# EAGLE design main (EAGLE 9.1.0)
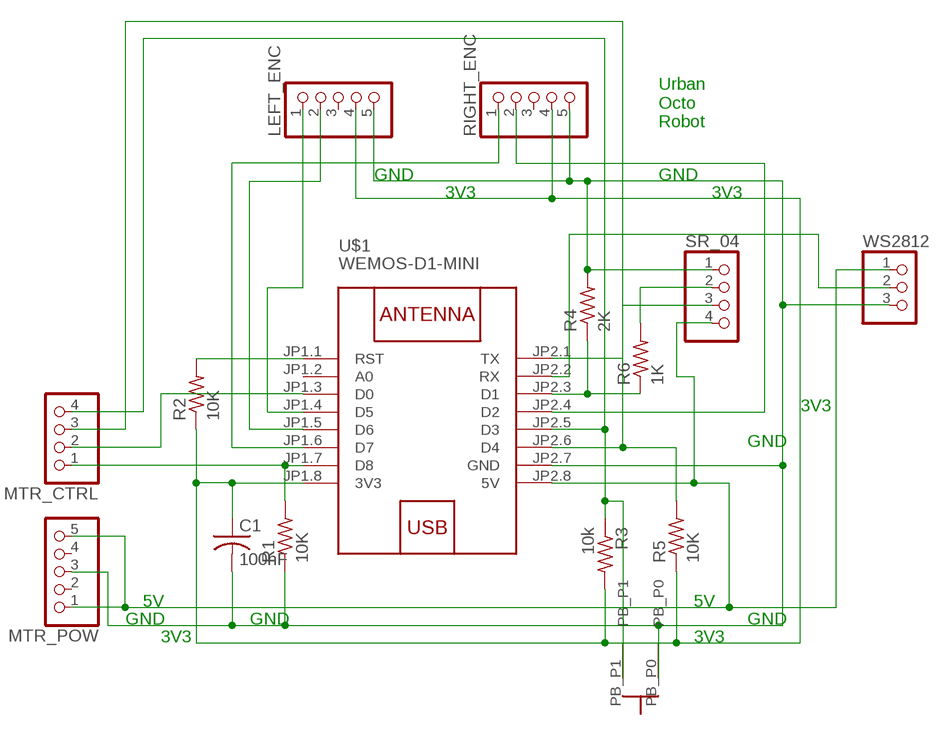
[diagram p0: schematic, sheet 1]

## Parts
C1  100nF  C-US050-024X044  [C050-024X044]
LEFT_ENC  PINHD-1X5  [1X05]
MTR_CTRL  PINHD-1X4  [1X04]
MTR_POW  PINHD-1X5/90  [1X05/90]
R1  10K  R-US_0204/7  [0204/7]
R2  10K  R-US_0204/7  [0204/7]
R3  10k  R-US_0207/2V  [0207/2V]
R4  2K  R-US_0309/V  [0309V]
R5  10K  R-US_0204/7  [0204/7]
R6  1K  R-US_0309/V  [0309V]
RIGHT_ENC  PINHD-1X5  [1X05]
SR_04  PINHD-1X4  [1X04]
U$1  WEMOS-D1-MINI  [WEMOS-D1-MINI]
U$7  BUTTON6X6X10MMSIDE  [BUTTON6X6X10MMSIDE]
WS2812  PINHD-1X3  [1X03]

## Nets
N$1: U$1.JP2.2(RX) WS2812.2
N$2: MTR_POW.1 MTR_POW.5 SR_04.4 U$1.JP2.8(5V) WS2812.1
N$3: LEFT_ENC.1 U$1.JP1.4(D5)
N$4: MTR_CTRL.2 U$1.JP1.3(D0)
N$5: RIGHT_ENC.2 U$1.JP2.4(D2)
N$6: LEFT_ENC.2 U$1.JP1.5(D6)
N$7: RIGHT_ENC.1 U$1.JP1.6(D7)
N$8: C1.1 LEFT_ENC.4 R2.1 R3.2 R5.1 RIGHT_ENC.4 U$1.JP1.8(3V3)
N$9: R6.2 SR_04.2
N$10: MTR_CTRL.4 R3.1 U$1.JP2.5(D3) U$7.PB_P1
N$11: R4.1 R6.1 U$1.JP2.3(D1)
N$12: SR_04.3 U$1.JP2.1(TX)
N$13: MTR_CTRL.3 R5.2 U$1.JP2.6(D4)
N$14: R2.2 U$1.JP1.1(RST)
N$15: MTR_CTRL.1 R1.2 U$1.JP1.7(D8)
N$16: C1.2 LEFT_ENC.5 MTR_POW.3 R1.1 R4.2 RIGHT_ENC.5 SR_04.1 U$1.JP2.7(GND) U$7.PB_P0 WS2812.3
Unconnected: LEFT_ENC.3 MTR_POW.2 MTR_POW.4 RIGHT_ENC.3 U$1.JP1.2(A0)

## Notes on the sheet
- Urban
  Octo
  Robot
- GND | GND
- 3V3 | 3V3
- 3V3
- GND
- 5V | 5V
- GND | GND | GND
- 3V3 | 3V3

## Library data of the parts
C1 = resistor:C-US: CAPACITOR, American symbol
LEFT_ENC MTR_POW RIGHT_ENC = pinhead:PINHD-1X5: PIN HEADER
MTR_CTRL SR_04 = pinhead:PINHD-1X4: PIN HEADER
R1-R6 = resistor:R-US_: RESISTOR, American symbol
U$1 = diy-modules:WEMOS-D1-MINI: WEMOS D1 mini: Mini Wi-Fi Board based on ESP-8266 device More details can be found here: https://www.wemos.cc/product/d1-mini.html Click here to find device on ebay.com <http://www.ebay.com/sch/wemos+d1+mini+nodemcu>
U$7 = glowmouse_custom:BUTTON6X6X10MMSIDE
WS2812 = pinhead:PINHD-1X3: PIN HEADER

## Board
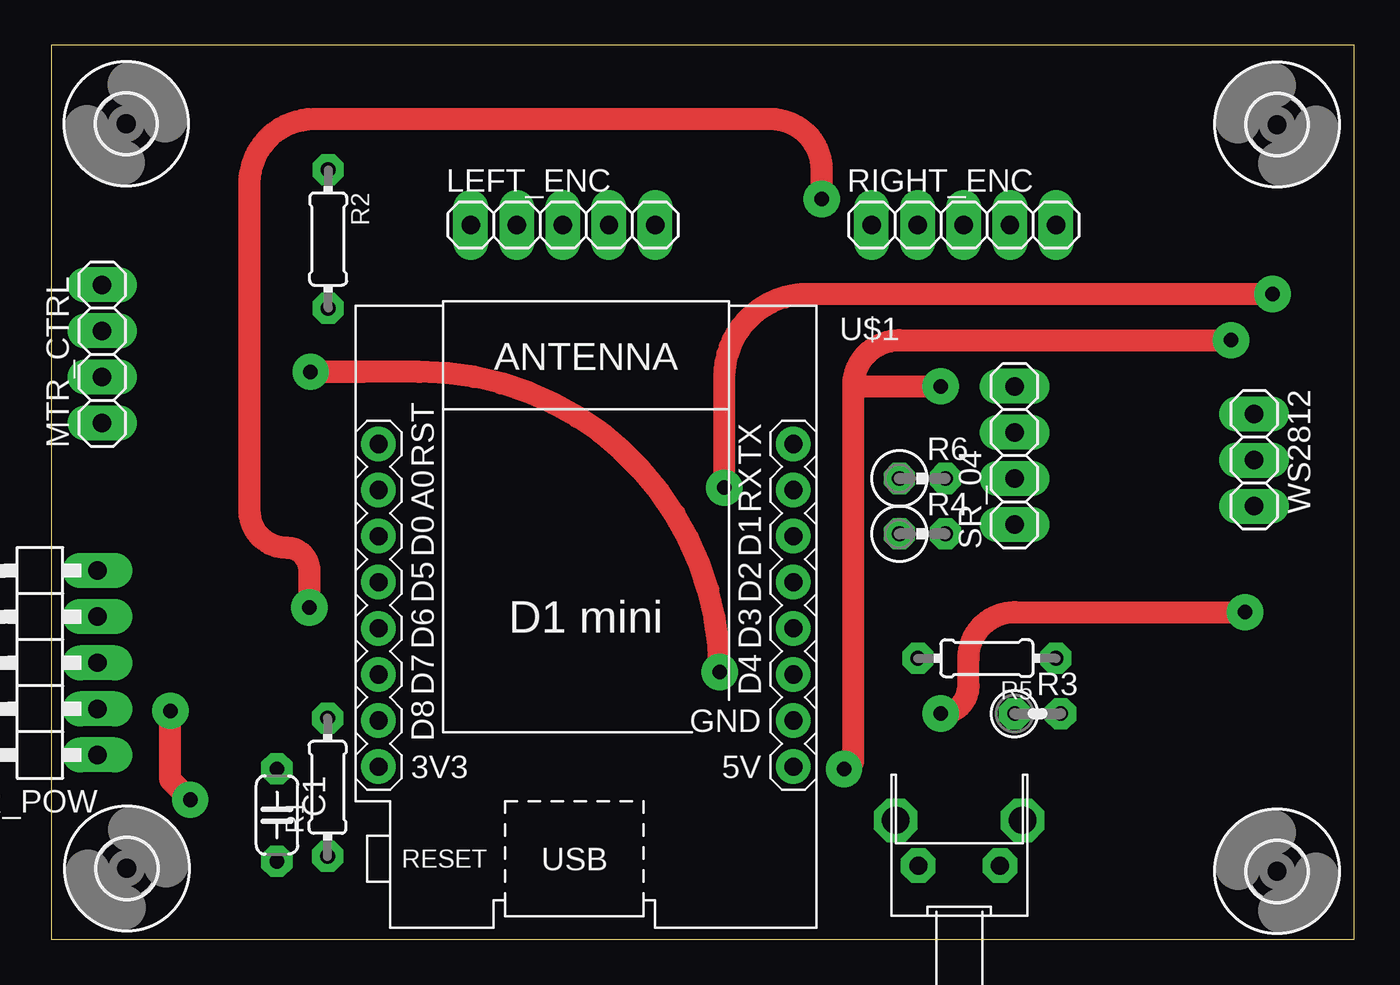
[diagram p1: board, top side]
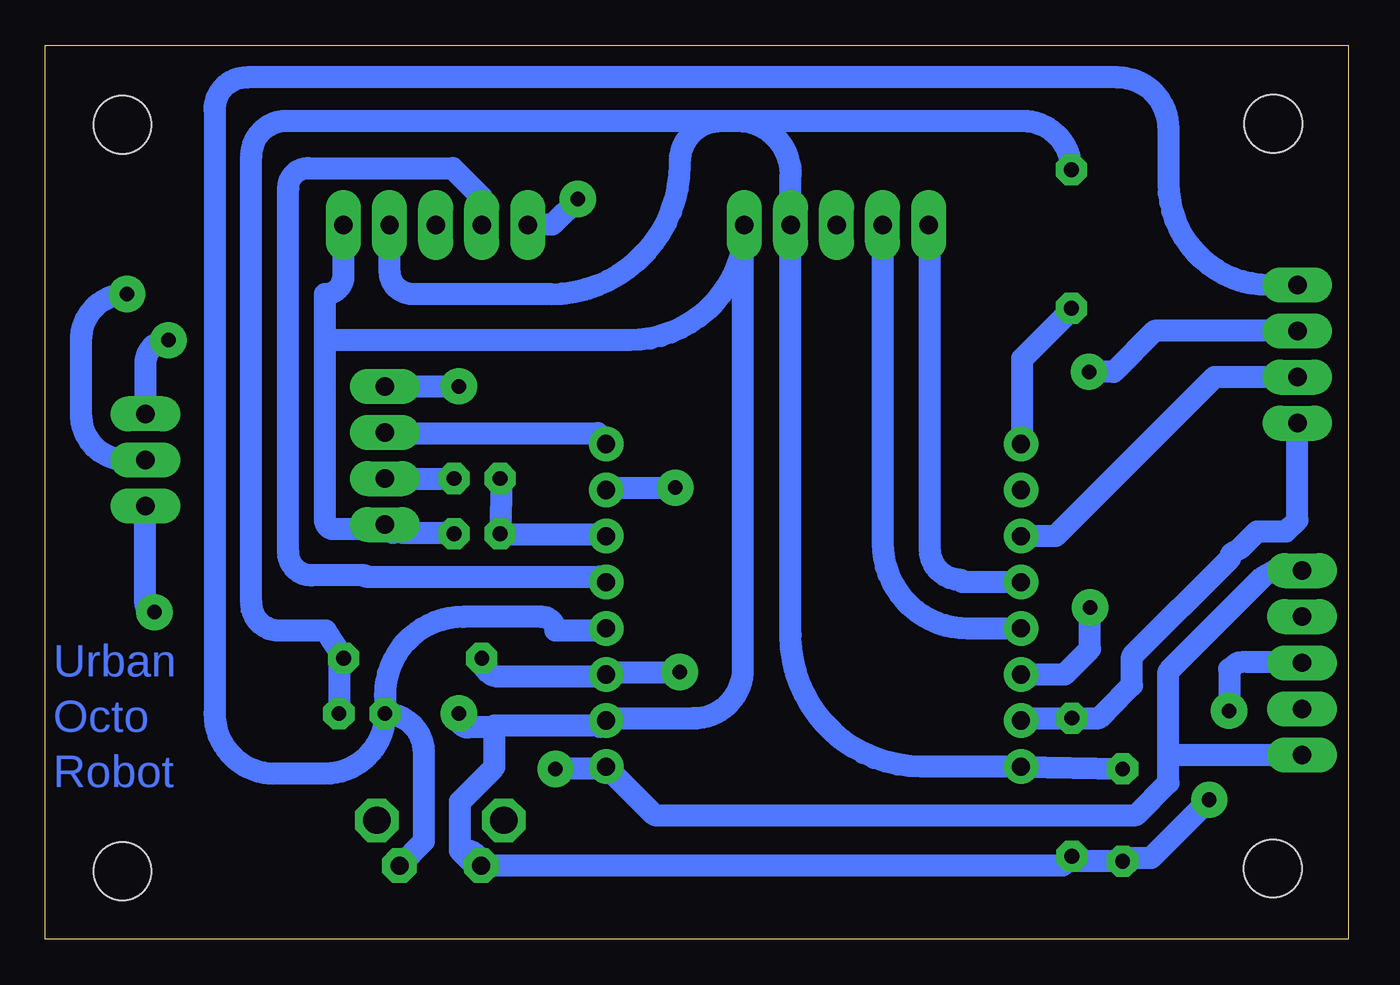
[diagram p2: board, bottom side, seen from below]

Size 71.81 x 49.27 mm. Coordinates in mm from the lower left corner, seen from the top.
Outline: 0,0 71.81,0 71.81,49.27 0,49.27 0,0
Copper layers (1*16): Top 0.035mm / dielectric 1.5mm / Bottom 0.035mm
Design rules "diy_board_drcs *": minimum track width 1.2mm, minimum drill 0.8mm, track to track 0.8mm, track to pad 0.6mm, pad to pad 0.8mm, via to via 1mm, smd to smd 8mil, copper to edge 40mil, drill to drill 8mil, minimum pad ring 0.4mm, minimum via ring 0.6mm, stop-mask expansion 4mil, vias tented up to drill 0mil, thermal gap 10mil

### Footprints (pad centres in the part's own frame; a part is rotated, then mirrored left to right if it is on the bottom)
C050-024X044 = drill 0.813 octagon: 1 -2.54,0; 2 2.54,0
1X05 = drill 1.016 long: 1 -5.08,0; 2 -2.54,0; 3 0,0; 4 2.54,0; 5 5.08,0
1X04 = drill 1.016 long: 1 -3.81,0; 2 -1.27,0; 3 1.27,0; 4 3.81,0
1X05/90 = drill 1.016 long: 1 -5.08,-3.81; 2 -2.54,-3.81; 3 0,-3.81; 4 2.54,-3.81; 5 5.08,-3.81
0204/7 = drill 0.813 octagon: 1 -3.81,0; 2 3.81,0
0207/2V = drill 0.813 octagon: 1 -1.27,0; 2 1.27,0
0309V = drill 0.813 octagon: 1 -1.27,0; 2 1.27,0
WEMOS-D1-MINI = drill 1: JP1.1 -11.43,9.525; JP1.2 -11.43,6.985; JP1.3 -11.43,4.445; JP1.4 -11.43,1.905; JP1.5 -11.43,-0.635; JP1.6 -11.43,-3.175; JP1.7 -11.43,-5.715; JP1.8 -11.43,-8.255; JP2.1 11.43,9.525; JP2.2 11.43,6.985; JP2.3 11.43,4.445; JP2.4 11.43,1.905; JP2.5 11.43,-0.635; JP2.6 11.43,-3.175; JP2.7 11.43,-5.715; JP2.8 11.43,-8.255
3,2 = hole 3.2: 0,0
BUTTON6X6X10MMSIDE = drill 1.5 octagon: P$3 3.5,2.5; P$4 -3.5,2.5 | drill 1 octagon: PB_P0 -2.25,0; PB_P1 2.25,0
1X03 = drill 1.016 long: 1 -2.54,0; 2 0,0; 3 2.54,0

### Placement (x,y rotation side)
C1  12.43,6.86 270 top
LEFT_ENC  28.19,39.37 0 top
MTR_CTRL  2.79,32.26 90 top
MTR_POW  -1.27,15.25 90 top
R1  15.22,8.39 90 top
R2  15.25,38.6 270 top
R3  54.36,12.45 0 top
R4  48.01,22.35 0 top
R5  51.56,15.49 180 top
R6  48.01,25.4 0 top
RIGHT_ENC  50.29,39.37 0 top
SR_04  53.09,26.67 90 top
U$1  29.46,17.78 0 top
U$2  [3,2]  4.16,3.91 0 top
U$3  [3,2]  67.56,44.9 270 top
U$4  [3,2]  4.12,44.95 0 top
U$5  [3,2]  67.56,3.75 270 top
U$7  50.04,4.06 0 top
WS2812  66.29,26.42 270 top

### Tracks (layer width: path | path; a pad name or v marks a point on that pad's centre or on a via)
N$1  (via drill 0.8)
  Top 1.2: 67.56,35.56 v67.31,35.56 41.66,35.56 arc90 37.08,30.99 v37.08,24.89
  Bottom 1.2: U$1.JP2.2 arc90 40.77,24.89 v37.08,24.89 36.83,24.89 | v67.31,35.56 arc-90 69.85,33.02 69.85,28.96 arc-90 67.31,26.42 WS2812.2
N$2  (via drill 0.8)
  Top 1.2: 44.2,30.48 v49.02,30.48 | v43.69,9.4 arc90 44.2,9.91 44.2,30.48 | 44.2,30.48 arc-90 46.74,33.02 v65.02,33.02
  Bottom 1.2: U$1.JP2.8 38.23,6.86 11.68,6.86 9.91,8.64 9.91,10.16 | 9.91,10.16 9.91,14.77 4.73,19.95 4.06,20.32 MTR_POW.5 | MTR_POW.1 9.91,10.16 | 53.06,30.4 SR_04.4 v49.02,30.48 | U$1.JP2.8 arc90 41.02,9.4 | U$1.JP2.8 arc90 41.02,9.4 | 41.02,9.4 v43.69,9.4 | v65.02,33.02 arc-90 66.29,31.75 WS2812.1
N$3
  Bottom 1.2: LEFT_ENC.1 23.05,39.3 23.05,21.53 arc-90 21.34,19.81 arc-90 21.21,19.68 U$1.JP1.4
N$4
  Bottom 1.2: MTR_CTRL.2 7.37,30.99 16.13,22.23 U$1.JP1.3
N$5
  Bottom 1.2: U$1.JP2.4 40.95,19.7 41.25,20 54.15,20 arc-90 54.22,20.07 57.15,20.07 arc90 58.42,21.34 58.42,41.4 arc90 57.32,42.5 49.35,42.5 47.75,40.9 47.75,39.4 RIGHT_ENC.2
N$6
  Bottom 1.2: LEFT_ENC.2 25.65,21.84 arc-90 20.96,17.14 U$1.JP1.5
N$7  (via drill 0.8)
  Top 1.2: v42.45,40.8 42.45,42.38 arc90 39.62,45.21 14.48,45.21 arc90 10.92,41.66 10.92,23.62 arc90 12.95,21.59 arc-90 14.22,20.32 v14.22,18.29
  Bottom 1.2: v42.45,40.8 43.85,39.4 45.15,39.4 RIGHT_ENC.1 | U$1.JP1.6 15.62,14.61 14.22,16 v14.22,18.29
N$8
  Bottom 1.2: U$1.JP1.8 C1.1 | R3.2 55.63,15.24 arc90 R5.1 56.35,17.02 58.93,17.02 arc90 60.45,18.54 60.45,43.18 arc90 58.52,45.11 34.54,45.11 | RIGHT_ENC.4 52.83,36.83 arc-90 51.56,35.56 43.97,35.56 arc-90 36.83,42.7 36.83,42.82 arc90 34.54,45.11 | 18.05,9.5 U$1.JP1.8 | 33.68,45.11 arc90 30.73,42.16 LEFT_ENC.4 30.73,16.76 arc-90 23.5,9.53 U$1.JP1.8 | 34.54,45.11 33.68,45.11 | 33.68,45.11 17.96,45.11 arc90 R2.1
N$9
  Bottom 1.2: 52.3,25.4 SR_04.2 R6.2
N$10
  Bottom 1.2: 2.91,35.9 MTR_CTRL.4 4.32,36.07 arc90 9.91,41.66 9.91,44.7 arc-90 12.7,47.5 60.71,47.5 arc-90 62.48,45.72 62.48,12.45 arc-90 59.18,9.14 56.39,9.14 arc-90 R3.1 | U$1.JP2.5 arc90 41.02,17.02 43.69,17.02 arc-90 44.45,17.78 48.77,17.78 arc-90 53.09,13.46 R3.1 | R3.1 arc90 50.95,10.31 50.95,5.4 52.25,4.1 U$7.PB_P1
N$11
  Bottom 1.2: 40.95,22.2 U$1.JP2.3 41.55,22.3 46.72,22.3 R4.1 46.67,25.4 | 46.67,25.4 | R6.1 46.75,25.4 46.67,25.4
N$12
  Bottom 1.2: 40.95,27.3 U$1.JP2.1 41.25,27.8 41.35,27.9 53.06,27.9 SR_04.3
N$13  (via drill 0.8)
  Top 1.2: 17.18,31.28 v14.28,31.28 20.28,31.28 arc-90 v36.83,14.73
  Bottom 1.2: 14.26,31.3 v14.28,31.28 12.92,31.28 10.67,33.53 MTR_CTRL.3 | R5.2 arc-90 46.74,14.48 41.02,14.48 arc-90 U$1.JP2.6 arc90 40.77,14.73 v36.83,14.73
N$14
  Bottom 1.2: R2.2 15.25,34.7 17.95,32 17.95,27.4 U$1.JP1.1
N$15
  Bottom 1.2: U$1.JP1.7 arc90 17.9,12.2 R1.2 13.72,12.2 13.72,12.19 13.3,12.61 11.91,14 11.91,15.6 6.51,20.99 6.43,21.28 5.95,21.55 5.02,22.49 3.42,22.49 2.79,23.11 MTR_CTRL.1
N$16  (via drill 0.8)
  Top 1.2: v6.55,12.6 6.55,8.8 v7.65,7.7 | v49.02,12.45 arc90 50.55,13.97 50.55,15.49 arc-90 53.09,18.03 v65.79,18.03
  Bottom 1.2: 53.02,22.82 SR_04.1 | 49.32,22.4 R4.2 49.85,22.4 52.1,22.4 SR_04.1 | 52.66,22.4 SR_04.1 | U$7.PB_P0 47.63,3.91 | v6.55,12.6 6.55,14.9 6.1,15.24 5.55,15.3 2.55,15.3 MTR_POW.3 | v7.65,7.7 10.85,4.5 11.85,4.5 C1.2 14.96,4.32 R1.1 15.74,4.06 U$7.PB_P0 | 41.25,11.7 40.95,12 U$1.JP2.7 | 40.35,12.1 U$1.JP2.7 | 47.05,11.8 41.75,11.8 U$1.JP2.7 | 47.05,11.8 47.05,9.5 48.95,7.6 48.95,4.9 | 48.35,4.3 48.95,4.9 | U$1.JP2.7 arc90 40.77,12.19 36.07,12.19 arc-90 33.35,14.91 33.35,39.3 LEFT_ENC.5 arc90 39.62,33.02 56.39,33.02 | 53.34,22.61 53.65,22.61 | 53.65,22.61 55.88,22.61 arc90 56.39,23.11 56.39,33.02 | 56.39,33.02 56.39,35.56 arc-90 55.37,36.58 RIGHT_ENC.5 | U$7.PB_P0 arc-90 48.62,4.9 48.95,4.9 | 47.05,11.8 arc90 47.17,11.68 48.51,11.68 arc90 49.02,12.19 v49.02,12.45 | v65.79,18.03 arc90 66.29,18.54 WS2812.3 | 53.65,22.61 53.65,22.7 SR_04.1

### Text on the board
Bottom: Urban | Octo | Robot